# Altium schematic sheet VS1053.SchDoc
size A3; Organization: Altium Limited; Address1: L3, 12a Rodborough Rd; Address2: Frenchs Forest; Address3: NSW; Address4: Australia 2086
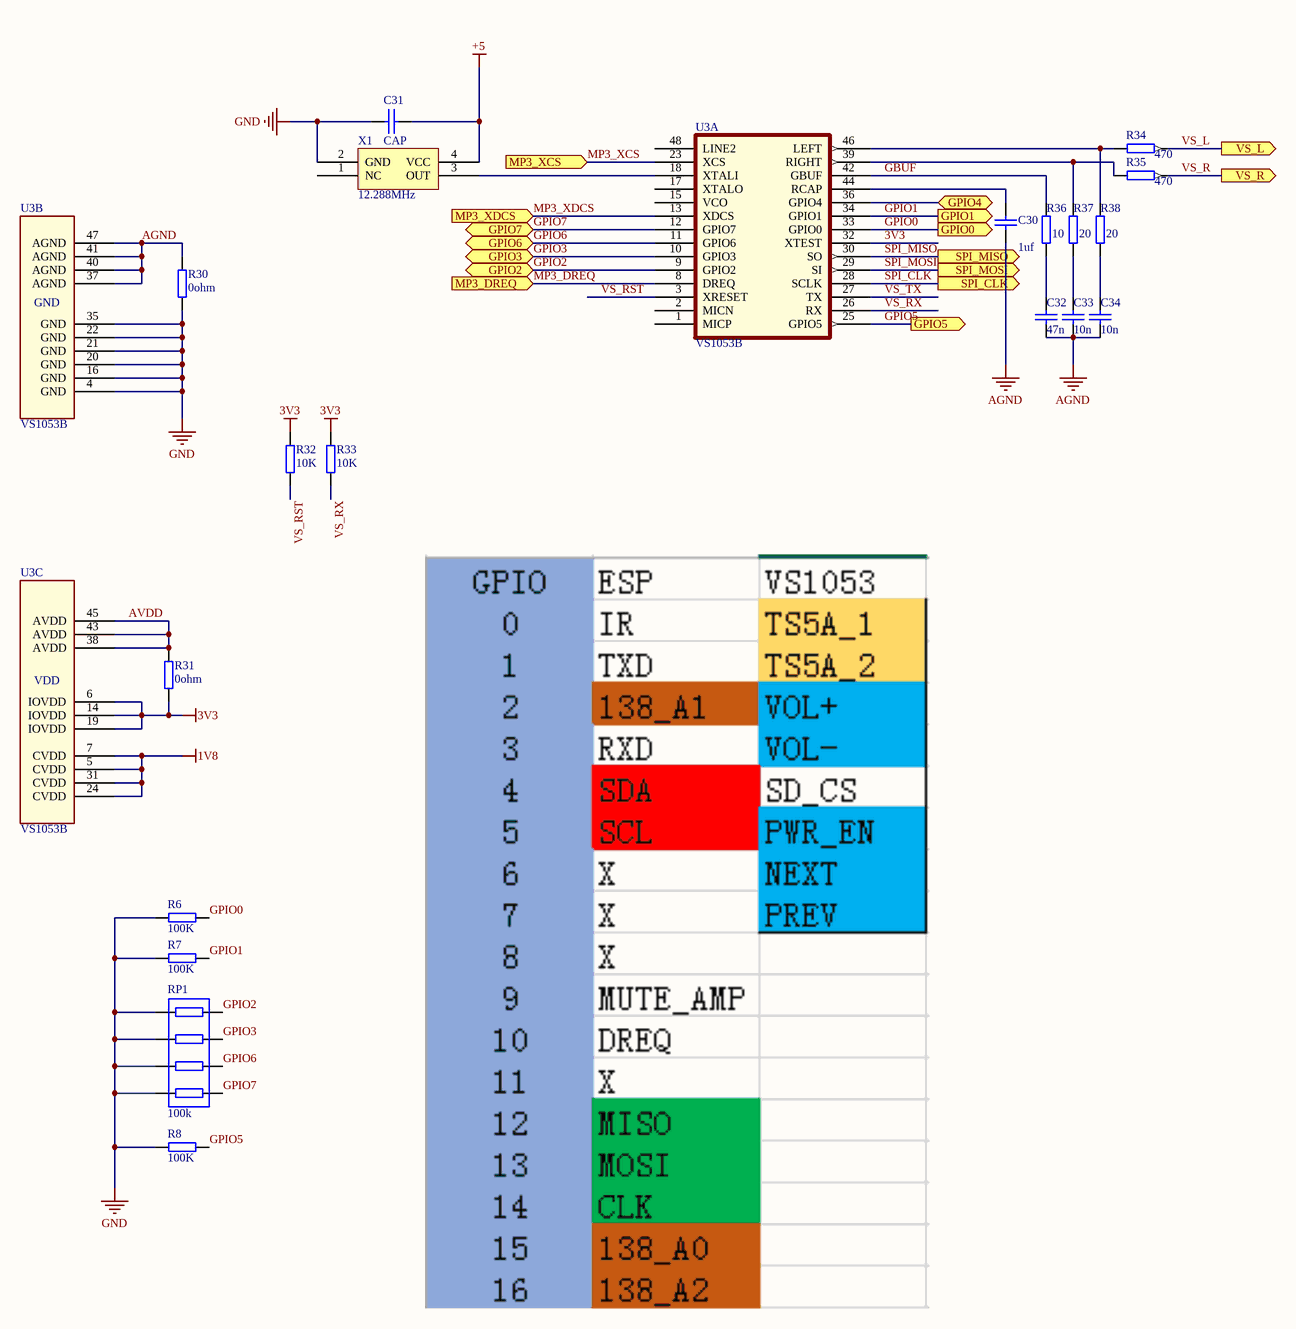
[diagram p0: VS1053.SchDoc]

## Parts
C30  value 1uf  [0402]  (hidden comment: Cap)
C31  CAP  [3528]
C32  value 47n  [0402]
C33  value 10n  [0402]  (hidden comment: Cap)
C34  value 10n  [0402]  (hidden comment: Cap)
R6  100K  [0603AR]
R7  100K  [0603AR]
R8  100K  [0603AR]
R30  0ohm  [0603AC]
R31  0ohm  [0603AC]
R32  10K  [0603AR]
R33  10K  [0603AR]
R34  470  [0603AR]
R35  470  [0603AR]
R36  10  [0603AC]
R37  20  [0603AC]
R38  20  [0603AC]
RP1  100k  [RN8]
U3  VS1053B  [LQFP-48]  (parts A,B,C of 3)
X1  12.288MHz  [DIL-14]

## Ports
GPIO0 (out), GPIO1 (out), GPIO2 (bidir), GPIO3 (bidir), GPIO4 (bidir), GPIO5 (out), GPIO6 (bidir), GPIO7 (bidir), MP3_DREQ (in), MP3_XCS (in), MP3_XDCS (in), SPI_CLK (out), SPI_MISO (out), SPI_MOSI (out), VS_L (out), VS_R (out)

## Nets
1V8: U3.5(CVDD) U3.7(CVDD) U3.24(CVDD) U3.31(CVDD)
3V3: R31.1 R32.2 R33.2 U3.6(IOVDD) U3.14(IOVDD) U3.19(IOVDD) U3.32(XTEST)
+5: C31.1 X1.4(VCC)
AGND: C30.1 C32.1 C33.1 C34.1 R30.2 U3.37(AGND) U3.40(AGND) U3.41(AGND) U3.47(AGND)
GND: C31.2 R6.1 R7.1 R8.1 R30.1 RP1.1 RP1.2 RP1.3 RP1.4 U3.4(GND) U3.16(GND) U3.20(GND) U3.21(GND) U3.22(GND) U3.35(GND) X1.2(GND)
AVDD: R31.2 U3.38(AVDD) U3.43(AVDD) U3.45(AVDD)
GBUF: R36.1 U3.42(GBUF)
GPIO0: R6.2 U3.33(GPIO0) ; port GPIO0
GPIO1: R7.2 U3.34(GPIO1) ; port GPIO1
GPIO2: RP1.8 U3.9(GPIO2) ; port GPIO2
GPIO3: RP1.7 U3.10(GPIO3) ; port GPIO3
GPIO4: U3.36(GPIO4) ; port GPIO4
GPIO5: R8.2 U3.25(GPIO5) ; port GPIO5
GPIO6: RP1.6 U3.11(GPIO6) ; port GPIO6
GPIO7: RP1.5 U3.12(GPIO7) ; port GPIO7
MP3_DREQ: U3.8(DREQ) ; port MP3_DREQ
MP3_XCS: U3.23(XCS) ; port MP3_XCS
MP3_XDCS: U3.13(XDCS) ; port MP3_XDCS
SPI_CLK: U3.28(SCLK) ; port SPI_CLK
SPI_MISO: U3.30(SO) ; port SPI_MISO
SPI_MOSI: U3.29(SI) ; port SPI_MOSI
VS_L: R34.2 ; port VS_L
VS_R: R35.2 ; port VS_R
VS_RST: R32.1 U3.3(XRESET)
VS_RX: R33.1 U3.26(RX)
VS_TX: U3.27(TX)
NetC30_2: C30.2 U3.44(RCAP)
NetC32_2: C32.2 R36.2
NetC33_2: C33.2 R37.2
NetC34_2: C34.2 R38.2
NetR34_1: R34.1 R38.1 U3.46(LEFT)
NetR35_1: R35.1 R37.1 U3.39(RIGHT)
NetU3_18: U3.18(XTALI) X1.3(OUT)

Not connected (* = marked no-connect by the designer): U3 1(MICP) 2(MICN) 15(VCO) 17(XTALO) 48(LINE2); X1 1(NC)

## Notes on the sheet
- Title
- Size:
- Date:
- A3
- Number:
- Time:
- Revision:
- Sheet
- of
- File:
- (in symbol VS1053B, part C) VDD

## Library data of the parts
C30 C32-C34 = Cap: 贴片电容; Published: 8-Jun-2000; LatestRevisionDate: 17-Jul-2002; LatestRevisionNote: Re-released for DXP Platform.; PackageReference: RAD-0.3; Publisher: Altium Limited
C31 = CAP: Capacitor
R6-R8 R30-R38 = RES2: Resistor
RP1 = RESPACK4A: Resistor Network
X1 = OSC: 有源晶振